# EAGLE schematic Attempt_1 (EAGLE 9.6.2)
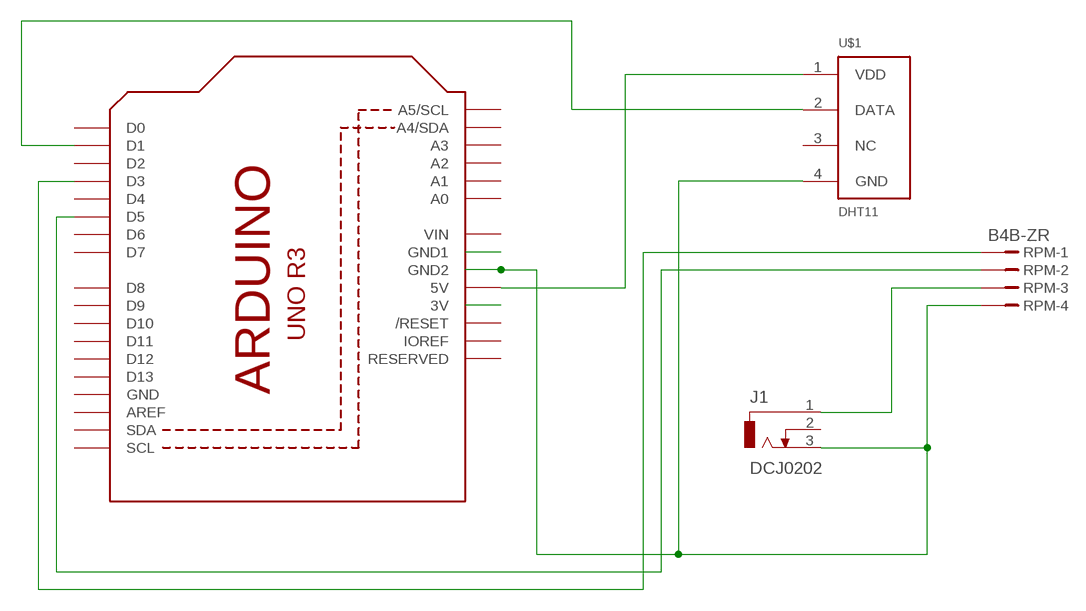
[diagram p0: schematic, sheet 1]

## Parts
J1  DCJ0202  [DCJ0202]
RPM  B4B-ZR  [B4B-ZR]
U1  ARDUINOR3-BPLACE  [ARDUINOR3-BPLACE]
U$1  DHT11  [DHT11]

## Nets
N$1: RPM.1 U1.D3
N$2: RPM.2 U1.D5
N$3: U1.5V U$1.1(VDD)
N$4: U1.D1 U$1.2(DATA)
N$5: J1.1 RPM.3
N$6: U1.GND1
N$8: J1.3 RPM.4 U1.GND2 U$1.4(GND)
N$9: U1.3V
Unconnected: J1.2 U1.A0 U1.A1 U1.A2 U1.A3 U1.A4(A4/SDA) U1.A5(A5/SCL) U1.AREF U1.D0 U1.D2 U1.D4 U1.D6 U1.D7 U1.D8 U1.D9 U1.D10 U1.D11 U1.D12 U1.D13 U1.IOREF U1.RESERVED U1.RESET(/RESET) U1.SCL U1.SDA U$1.3(NC)

## Power pins joined to a net without a drawn wire
GND: U1.GND
VIN: U1.VIN

## Library data of the parts
J1 = con-jack:DCJ0202: DC POWER JACK Source: DCJ0202.pdf; OC_FARNELL: unknown; OC_NEWARK: unknown
RPM = con-jst:?4B-ZR: ZH CONNECTOR 1.5 mm, 4 pin 1 row Source: http://www.jst.com .. eZH.pdf; MF: FARNELL; MPN: B4B-ZR(LF)(SN); OC_FARNELL: 1830916; OC_NEWARK: 37K9960
U1 = adafruit:ARDUINOR3: This is a new object for the new Arduino R3 - with extra pins that you may want to use (such as IOref, and duplicated A4/A5
U$1 = dht:DHT11